# EAGLE design quadcopter (EAGLE 9.5.1)
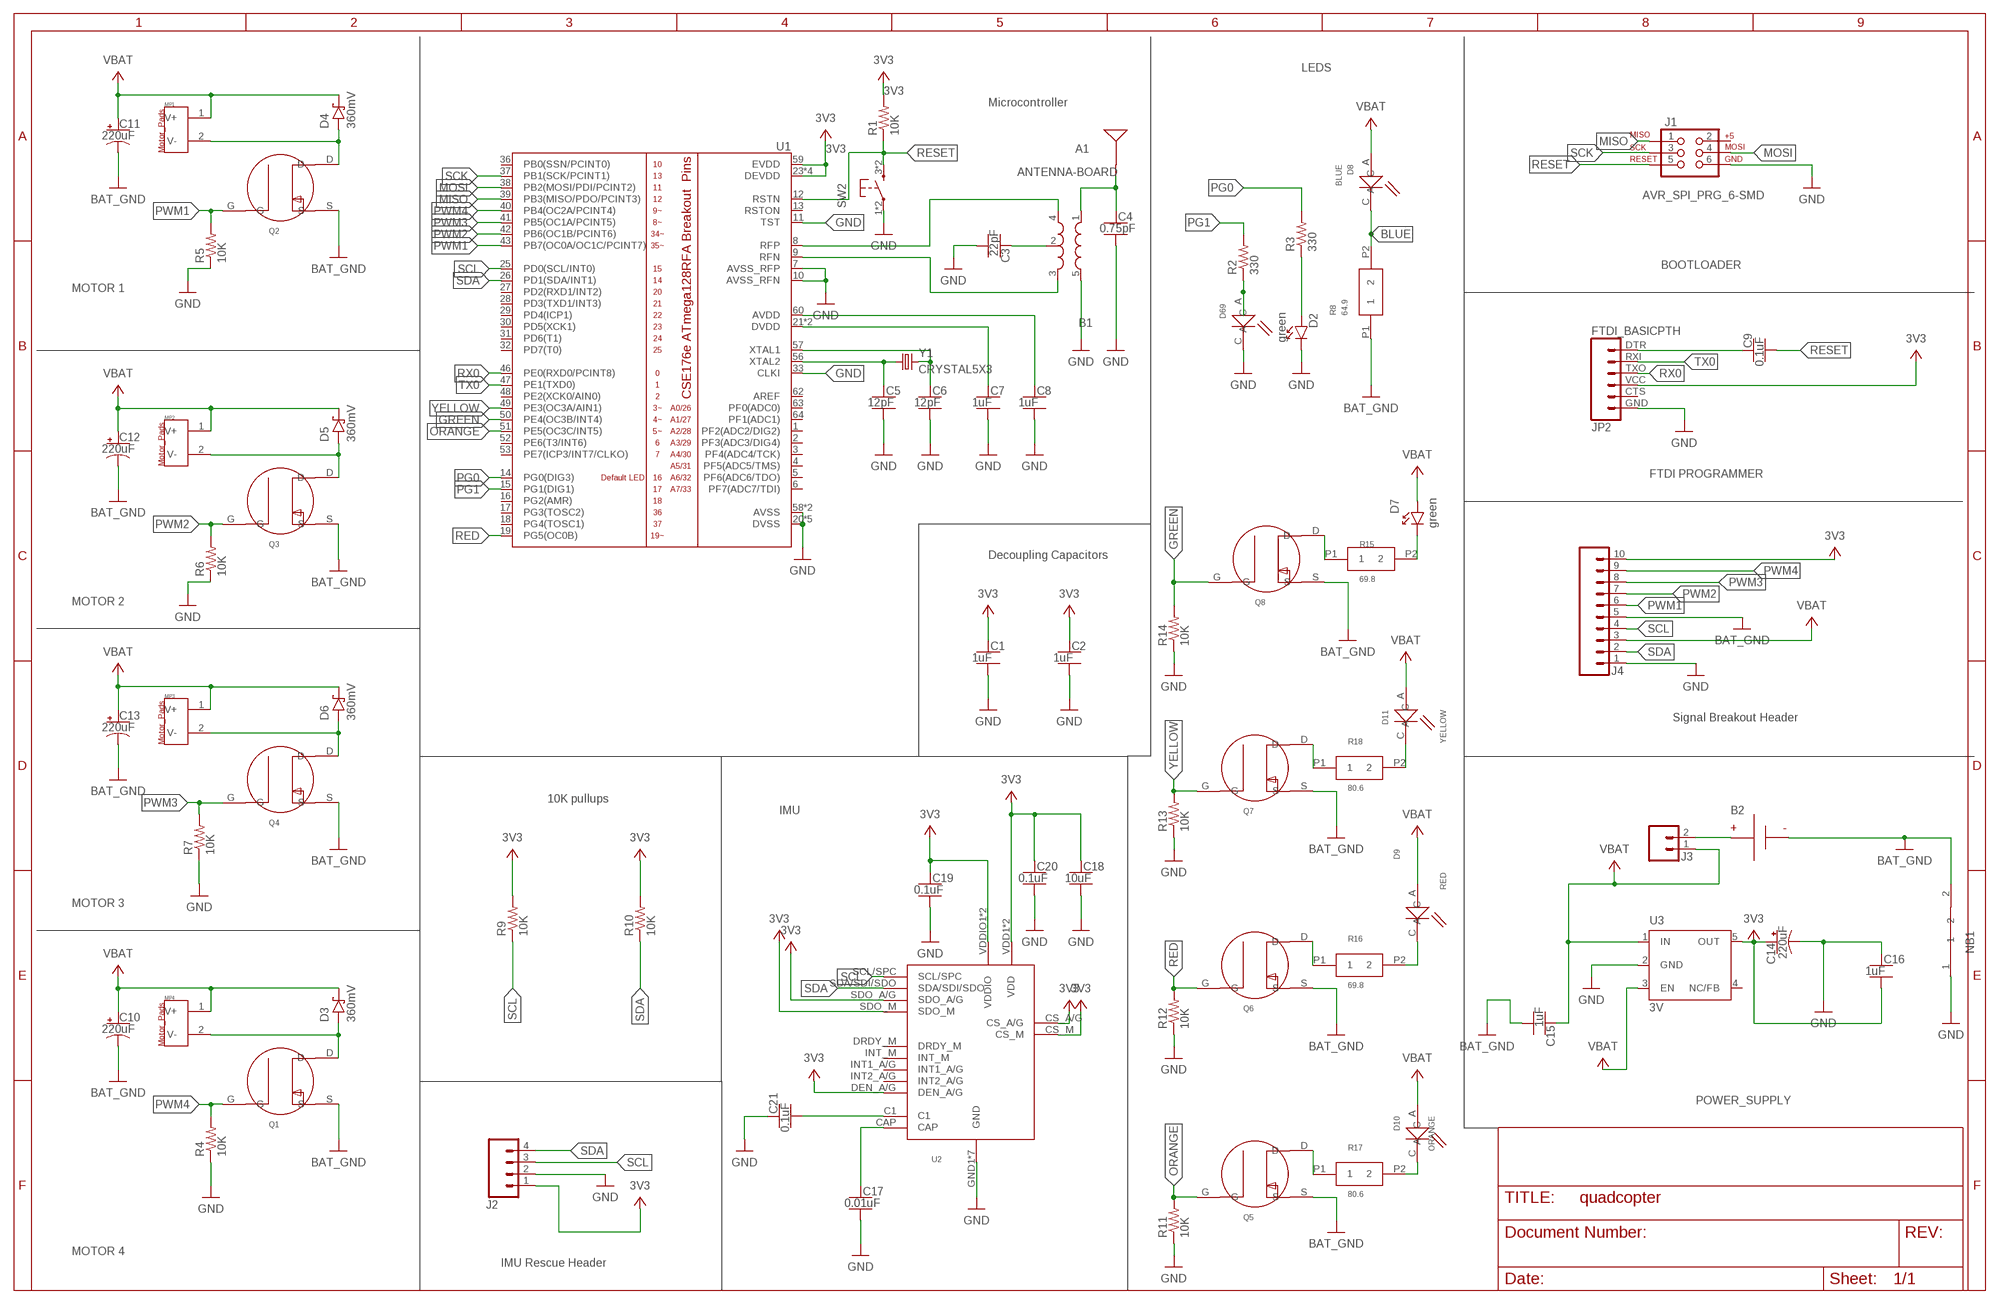
[diagram p0: schematic, sheet 1]
FRAME1 (FRAME_B_L): CREATOR: Unknown; DIST: Unknown; DISTPN: Unknown

## Parts
A1  ANTENNA-BOARD  [ANT_PCB_2.4GHZ_NRF8001_1.6MM_1OZ]
B1  BALUN0805  [BALUN]
B2  BATTERY-SCREW-TERMINAL  [SCREW-TERMINAL-1X2-2.54MM]
C1  1uF  CAPACITOR-NP_SMD-2012-0805_CERAMIC-1UF  [CAPC2012X140_HS]
C2  1uF  CAPACITOR-NP_SMD-2012-0805_CERAMIC-1UF  [CAPC2012X140_HS]
C3  22pF  CAPACITOR-NP_SMD-2012-0805_CERAMIC-22PF  [CAPC2012X140_HS]
C4  0.75pF  CAPACITOR-NP_SMD-2012-0805_CERAMIC-0.75PF  [CAPC2012X140_HS]
C5  12pF  CAPACITOR-NP_SMD-2012-0805_CERAMIC-12PF  [CAPC2012X140_HS]
C6  12pF  CAPACITOR-NP_SMD-2012-0805_CERAMIC-12PF  [CAPC2012X140_HS]
C7  1uF  CAPACITOR-NP_SMD-2012-0805_CERAMIC-1UF  [CAPC2012X140_HS]
C8  1uF  CAPACITOR-NP_SMD-2012-0805_CERAMIC-1UF  [CAPC2012X140_HS]
C9  0.1uF  CAPACITOR-NP_SMD-2012-0805_CERAMIC-0.1UF  [CAPC2012X140_HS]
C10  220uF  CAPACITOR-POL_SMD-7043-D_TANTALUM-220UF  [CAPMP7343X310_HS]
C11  220uF  CAPACITOR-POL_SMD-7043-D_TANTALUM-220UF  [CAPMP7343X310_HS]
C12  220uF  CAPACITOR-POL_SMD-7043-D_TANTALUM-220UF  [CAPMP7343X310_HS]
C13  220uF  CAPACITOR-POL_SMD-7043-D_TANTALUM-220UF  [CAPMP7343X310_HS]
C14  220uF  CAPACITOR-POL_SMD-7043-D_TANTALUM-220UF  [CAPMP7343X310_HS]
C15  1uF  CAPACITOR-NP_SMD-2012-0805_CERAMIC-1UF  [CAPC2012X140_HS]
C16  1uF  CAPACITOR-NP_SMD-2012-0805_CERAMIC-1UF  [CAPC2012X140_HS]
C17  0.01uF  CAPACITOR-NP_SMD-2012-0805_CERAMIC-0.01UF  [CAPC2012X140_HS]
C18  10uF  CAPACITOR-NP_SMD-2012-0805_CERAMIC-10UF  [CAPC2012X140_HS]
C19  0.1uF  CAPACITOR-NP_SMD-2012-0805_CERAMIC-0.1UF  [CAPC2012X140_HS]
C20  0.1uF  CAPACITOR-NP_SMD-2012-0805_CERAMIC-0.1UF  [CAPC2012X140_HS]
C21  0.1uF  CAPACITOR-NP_SMD-2012-0805_CERAMIC-0.1UF  [CAPC2012X140_HS]
D2  green  DIODE-LED_SMD-2012-0805-GREEN  [LEDSC125X200X120-2_HS]
D3  360mV  DIODE-SCHOTTKY_SMD-SOD123-360MV  [SOD3716X135_HS]
D4  360mV  DIODE-SCHOTTKY_SMD-SOD123-360MV  [SOD3716X135_HS]
D5  360mV  DIODE-SCHOTTKY_SMD-SOD123-360MV  [SOD3716X135_HS]
D6  360mV  DIODE-SCHOTTKY_SMD-SOD123-360MV  [SOD3716X135_HS]
D7  green  DIODE-LED_SMD-2012-0805-GREEN  [LEDSC125X200X120-2_HS]
D8  BLUE  LED-BLUE  [0805_LED]
D9  RED  LEDRED  [0805_LED]
D10  ORANGE  LED-ORANGE  [0805_LED]
D11  YELLOW  LED-YELLOW  [0805_LED]
D69  LEDRED  [0805_LED]
J1  AVR_SPI_PRG_6-SMD  [2X3-SMD]
J2  HEADER-4POS-0.1IN-FEMALE  [HDRVR4W80P254_1X4_1066X254X850B]
J3  HEADER-0.1IN-2POS-MALE  [HDRV2W63P254_2X1_508X254H838_HS]
J4  HEADER-10POSTH-254X10  [HDRV10W63P254_10X1_2540X254H838_HS]
JP2  FTDI_BASICPTH  [FTDI_BASIC]
MP1  MOTOR_PADS-MOLEX-0530470210  [MOLEX-0530470210]
MP2  MOTOR_PADS-MOLEX-0530470210  [MOLEX-0530470210]
MP3  MOTOR_PADS-MOLEX-0530470210  [MOLEX-0530470210]
MP4  MOTOR_PADS-MOLEX-0530470210  [MOLEX-0530470210]
NB1  NETBRIDGE  [NET_BRIDGE]
Q1  NMOSFET-NMOSFET  [N-CH_MOSFET]
Q2  NMOSFET-NMOSFET  [N-CH_MOSFET]
Q3  NMOSFET-NMOSFET  [N-CH_MOSFET]
Q4  NMOSFET-NMOSFET  [N-CH_MOSFET]
Q5  NMOSFET-NMOSFET  [N-CH_MOSFET]
Q6  NMOSFET-NMOSFET  [N-CH_MOSFET]
Q7  NMOSFET-NMOSFET  [N-CH_MOSFET]
Q8  NMOSFET-NMOSFET  [N-CH_MOSFET]
R1  10K  RESISTOR_SMD-2012-0805-10K  [RESC2012X60_HS]
R2  330  RESISTOR_SMD-2012-0805-330  [RESC2012X60_HS]
R3  330  RESISTOR_SMD-2012-0805-330  [RESC2012X60_HS]
R4  10K  RESISTOR_SMD-2012-0805-10K  [RESC2012X60_HS]
R5  10K  RESISTOR_SMD-2012-0805-10K  [RESC2012X60_HS]
R6  10K  RESISTOR_SMD-2012-0805-10K  [RESC2012X60_HS]
R7  10K  RESISTOR_SMD-2012-0805-10K  [RESC2012X60_HS]
R8  64.9  RESISTOR-64.9OHM  [0805_RESISTOR]
R9  10K  RESISTOR_SMD-2012-0805-10K  [RESC2012X60_HS]
R10  10K  RESISTOR_SMD-2012-0805-10K  [RESC2012X60_HS]
R11  10K  RESISTOR_SMD-2012-0805-10K  [RESC2012X60_HS]
R12  10K  RESISTOR_SMD-2012-0805-10K  [RESC2012X60_HS]
R13  10K  RESISTOR_SMD-2012-0805-10K  [RESC2012X60_HS]
R14  10K  RESISTOR_SMD-2012-0805-10K  [RESC2012X60_HS]
R15  69.8  RESISTOR-69.8OHM  [0805_RESISTOR]
R16  69.8  RESISTOR-69.8OHM  [0805_RESISTOR]
R17  80.6  RESISTOR-80.6OHM  [0805_RESISTOR]
R18  80.6  RESISTOR-80.6OHM  [0805_RESISTOR]
SW2  PUSHBUTTON_-4.5X4.5  [4.5MM_TACTILE_SWITCH_TL3305AF160QG]
U1  ATMEGA128RFA1  [QFN-64]
U2  LSM9DS1TR9AXISIMU-ACCEL/GYRO/MAGI2C/SPI24LGA  [LSM9DS1TR9-AXISIMU]
U3  3V  TPS73633-DBVT3V  [SOT23-DBV]
Y1  CRYSTAL5X3  [CRYSTAL-SMD-5X3]

## Nets
3V3 [PWR]: C1.1 C2.1 C14.1(+) C16.2 C18.1 C19.1 C20.1 J2.1 J4.10 JP2.VCC R1.2 R9.2 R10.2 U1.23(DEVDD) U1.34(DEVDD) U1.44(DEVDD) U1.54(DEVDD) U1.59(EVDD) U2.CS_A/G U2.CS_M U2.DEN_A/G U2.SDO_A/G U2.SDO_M U2.VDD1(VDD) U2.VDD2(VDD) U2.VDDIO1(VDDIO) U2.VDDIO2(VDDIO) U3.5(OUT)
A2: B1.4(OUT1) U1.8(RFP)
A3: B1.2(GND) C3.1
A4: B1.3(OUT2) U1.9(RFN)
ANT1 [RFSIG]: A1.FEED(SIGNAL) B1.1(IN) C4.1
BAT_GND [HIGHCURRENT]: B2.1(N) C10.2(-) C11.2(-) C12.2(-) C13.2(-) C15.2 J4.5 NB1.2 Q1.S Q2.S Q3.S Q4.S Q5.S Q6.S Q7.S Q8.S R8.P1
BLUE: D8.C R8.P2
GND [PWR]: B1.5(GND) C1.2 C2.2 C3.2 C4.2 C5.2 C6.2 C7.2 C8.2 C14.2(-) C16.1 C17.2 C18.2 C19.2 C20.2 C21.1 D2.C D69.C J1.6 J2.2 J4.1 JP2.GND NB1.1 R4.1 R5.1 R6.1 R7.1 R11.1 R12.1 R13.1 R14.1 SW2.1 SW2.2 U1.7(AVSS_RFP) U1.10(AVSS_RFN) U1.11(TST) U1.20(DVSS) U1.24(DVSS) U1.33(CLKI) U1.35(DVSS) U1.45(DVSS) U1.55(DVSS) U1.58(AVSS) U1.61(AVSS) U2.GND1(GND) U2.GND2(GND) U2.RES1(GND) U2.RES2(GND) U2.RES3(GND) U2.RES4(GND) U2.RES5(GND) U3.2(GND)
GREEN: Q8.G R14.2 U1.50(PE4(OC3B/INT4))
MISO: J1.1 U1.39(PB3(MISO/PDO/PCINT3))
MOSI: J1.4 U1.38(PB2(MOSI/PDI/PCINT2))
N$1: C5.1 U1.56(XTAL2) Y1.1
N$2: C6.1 U1.57(XTAL1) Y1.3
N$3: D2.A R3.1
N$4 [HIGHCURRENT]: B2.2(P) J3.2
N$5: C7.1 U1.21(DVDD) U1.22(DVDD)
N$6: C8.1 U1.60(AVDD)
N$7: D7.C R15.P2
N$8: Q8.D R15.P1
N$9: Q7.D R18.P1
N$13: D9.C R16.P2
N$14: Q6.D R16.P1
N$16: D10.C R17.P2
N$17: D11.C R18.P2
N$18: Q5.D R17.P1
N$22: D69.A R2.1
N$33: C9.1 JP2.DTR
N$35 [HIGHCURRENT]: D3.A MP4.2(V-) Q1.D
N$42 [HIGHCURRENT]: D4.A MP1.2(V-) Q2.D
N$44 [HIGHCURRENT]: D5.A MP2.2(V-) Q3.D
N$45: C17.1 U2.CAP
N$46 [HIGHCURRENT]: D6.A MP3.2(V-) Q4.D
N$50: C21.2 U2.C1
ORANGE: Q5.G R11.2 U1.51(PE5(OC3C/INT5))
PG0: R3.2 U1.14(PG0(DIG3))
PG1: R2.2 U1.15(PG1(DIG1))
PWM1: J4.6 Q2.G R5.2 U1.43(PB7(OC0A/OC1C/PCINT7))
PWM2: J4.7 Q3.G R6.2 U1.42(PB6(OC1B/PCINT6))
PWM3: J4.8 Q4.G R7.2 U1.41(PB5(OC1A/PCINT5))
PWM4: J4.9 Q1.G R4.2 U1.40(PB4(OC2A/PCINT4))
RED: Q6.G R12.2 U1.19(PG5(OC0B))
RESET: C9.2 J1.5 R1.1 SW2.3 SW2.4 U1.12(RSTN)
RX0: JP2.TXO U1.46(PE0(RXD0/PCINT8))
SCK: J1.3 U1.37(PB1(SCK/PCINT1))
SCL: J2.3 J4.4 R9.1 U1.25(PD0(SCL/INT0)) U2.SCL/SPC
SDA: J2.4 J4.2 R10.1 U1.26(PD1(SDA/INT1)) U2.SDA/SDI/SDO
TX0: JP2.RXI U1.47(PE1(TXD0))
VBAT [HIGHCURRENT]: C10.1(+) C11.1(+) C12.1(+) C13.1(+) C15.1 D3.C D4.C D5.C D6.C D7.A D8.A D9.A D10.A D11.A J3.1 J4.3 MP1.1(V+) MP2.1(V+) MP3.1(V+) MP4.1(V+) U3.1(IN) U3.3(EN)
YELLOW: Q7.G R13.2 U1.49(PE3(OC3A/AIN1))
Unconnected: J1.2 JP2.CTS U1.1(PF2(ADC2/DIG2)) U1.2(PF3(ADC3/DIG4)) U1.3(PF4(ADC4/TCK)) U1.4(PF5(ADC5/TMS)) U1.5(PF6(ADC6/TDO)) U1.6(PF7(ADC7/TDI)) U1.13(RSTON) U1.16(PG2(AMR)) U1.17(PG3(TOSC2)) U1.18(PG4(TOSC1)) U1.27(PD2(RXD1/INT2)) U1.28(PD3(TXD1/INT3)) U1.29(PD4(ICP1)) U1.30(PD5(XCK1)) U1.31(PD6(T1)) U1.32(PD7(T0)) U1.36(PB0(SSN/PCINT0)) U1.48(PE2(XCK0/AIN0)) U1.52(PE6(T3/INT6)) U1.53(PE7(ICP3/INT7/CLKO)) U1.62(AREF) U1.63(PF0(ADC0)) U1.64(PF1(ADC1)) U2.DRDY_M U2.INT1_A/G U2.INT2_A/G U2.INT_M U3.4(NC/FB)

## Notes on the sheet
- LEDS
- Microcontroller
- BOOTLOADER
- MOTOR 1
- FTDI PROGRAMMER
- Decoupling Capacitors
- MOTOR 2
- Signal Breakout Header
- 10K pullups
- IMU
- MOTOR 3
- POWER_SUPPLY
- MOTOR 4
- IMU Rescue Header

## Library data of the parts
A1 = quadparts_prebuilt:ANTENNA: Single endded antenna.; CREATOR: Swanson; DIST: NA; DISTPN: NA; MOUNTING: NONE
B1 = quadparts_prebuilt:BALUN: A balun to convert differential radio-frequency outputs from the microcontroller into a single-ended driver for the antenna.; CREATOR: Swanson; DATASHEET: http://katalog.we-online.de/pbs/datasheet/748421245.pdf; DIST: Digikey; DISTPN: 732-2230-1-ND; MFR: Wurth Electronics Inc; MOUNTING: SMD; MPN: 748421245; PRICE: 2.63; REVIEWER: Swanson
B2 = quadparts_prebuilt:BATTERY: Connections for a battery.; CREATOR: Swanson; DIST: DIGIKEY; DISTPN: ED10561-ND; MOUNTING: TH; PIN1: -; PIN2: +
C1 C2 C7 C8 C15 C16 = quadparts_prebuilt:CAPACITOR-NP_: Nonpolarized capacitor; CREATOR: Swanson; DIST: Digikey; DISTPN: 587-1281-1-ND; MFR: Taiyo Yuden; MOUNTING: SMD; MPN: TMK212B7105KG-T; REVIEWER: Swanson
C3 = quadparts_prebuilt:CAPACITOR-NP_: Nonpolarized capacitor; CREATOR: Swanson; DIST: Digikey; DISTPN: 490-5534-1-ND; MFR: Murata Electronics North America; MOUNTING: SMD; MPN: GRM21A5C2E220JW01D; REVIEWER: Swanson
C4 = quadparts_prebuilt:CAPACITOR-NP_: Nonpolarized capacitor; CREATOR: Swanson; DIST: Digikey; DISTPN: 490-3585-1-ND; MFR: Murata Electronics North America; MOUNTING: SMD; MPN: GQM2195C2AR75CB01D; REVIEWER: Swanson
C5 C6 = quadparts_prebuilt:CAPACITOR-NP_: Nonpolarized capacitor; CREATOR: Swanson; DIST: Digikey; DISTPN: 490-5531-1-ND; MFR: Murata Electronics North America; MOUNTING: SMD; MPN: GRM21A5C2E120JW01D; REVIEWER: Swanson
C9 C19-C21 = quadparts_prebuilt:CAPACITOR-NP_: Nonpolarized capacitor; CREATOR: Swanson; DIST: Digikey; DISTPN: 445-1418-1-ND; MFR: TDK; MOUNTING: SMD; MPN: C2012X7R2A104K125AA; REVIEWER: Swanson
C10-C14 = quadparts_prebuilt:CAPACITOR-POL_: Polarized capacitor; CREATOR: Swanson; DIST: Digikey; DISTPN: 478-8912-1-ND; MFR: AVX Corporation; MOUNTING: SMD; MPN: TAJD227K006RNJ; REVIEWER: Swanson
C17 = quadparts_prebuilt:CAPACITOR-NP_: Nonpolarized capacitor; CREATOR: Swanson; DIST: Digikey; DISTPN: 1608-1458-1-ND; MFR: Knowles Syfer; MOUNTING: SMD; MPN: 0805J0500104KJT; REVIEWER: Swanson
C18 = quadparts_prebuilt:CAPACITOR-NP_: Nonpolarized capacitor; CREATOR: Swanson; DIST: Digikey; DISTPN: 445-5984-1-ND; MOUNTING: SMD; REVIEWER: Swanson
D2 D7 = quadparts_prebuilt:DIODE-LED_: Light emitting diode; CREATOR: Swanson; DIST: Digikey; DISTPN: 160-1179-1-ND; MFR: Lite-On Inc; MOUNTING: SMD; MPN: LTST-C170GKT; REVIEWER: Swanson
D3-D6 = quadparts_prebuilt:DIODE-SCHOTTKY_: Schottky diode; CREATOR: Swanson; DIST: Digikey; DISTPN: CRS08QMCT-ND; MFR: Toshiba Semiconductor and Storage; MOUNTING: SMD; MPN: CRS08(TE85L,Q,M); REVIEWER: Swanson
D8 = LED:LED; CREATOR: robntom; DIST: digikey; DISTPN: 846-1207-1-ND
D9 D69 = custom:LED; CREATOR: robntom; DIST: digikey; DISTPN: 160-1178-1-ND
D10 = LED:LED; CREATOR: ROBTOM; DIST: Digikey; DISTPN: 754-1936-1-ND
D11 = LED:LED; CREATOR: ROBTOM; DIST: Digikey; DISTPN: 754-1937-1-ND
J1 = quadparts_prebuilt:AVR_SPI_PRG_6: AVR ISP 6 Pin This is the in-system programming (ISP) connector for Atmel Microcontrollers programming.; CREATOR: Swanson; DIST: Digikey; DISTPN: 952-1922-ND; MOUNTING: SMD
J2 = quadparts_prebuilt:HEADER-4POS; CREATOR: Swanson; DIST: Digikey; DISTPN: S7002-ND
J3 = quadparts_prebuilt:HEADER-0.1IN-2POS: 2 pin header; CREATOR: Swanson; DIST: Digikey; DISTPN: 3M9447-ND; MOUNTING: TH
J4 = quadparts_prebuilt:HEADER-10POS: 10 pin single inline pin header, socket, or connector; CREATOR: Swanson; DATASHEET: http://portal.fciconnect.com/Comergent//fci/drawing/68000.pdf; DIST: Digikey; DISTPN: 609-3250-ND; MFR: Amphenol FCI; MOUNTING: TH; MPN: 68000-110HLF; PRICE: 0.55; REVIEWER: Swanson
JP2 = quadparts_prebuilt:FTDI_BASIC: FTDI (USB-serial converter) header bins with labels.; CREATOR: Swanson; DATASHEET: http://portal.fciconnect.com/Comergent//fci/drawing/68015.pdf; DIST: Digikey; DISTPN: 609-3327-ND; MFR: Amphenol FCI; MOUNTING: TH; MPN: 68016-406HLF; PRICE: 0.33; REVIEWER: Swanson
MP1-MP4 = quadparts_prebuilt:MOTOR_PADS: Connections a brushed motor.; CREATOR: Swanson; DIST: DIGIKEY; DISTPN: WM1731-ND; MOUNTING: TH
NB1 = LED:NETBRIDGE; CREATOR: tom+rob; DIST: N/A; DISTPN: N/A
Q1-Q8 = custom:NMOSFET; CREATOR: rketch; DIST: Digikey; DISTPN: SI2302CDS-T1-E3CT-ND
R1 R4-R7 R9-R14 = quadparts_prebuilt:RESISTOR_: Resistor; CREATOR: Swanson; DIST: Digikey; DISTPN: 311-10KARCT-ND; MFR: Yageo; MOUNTING: SMD; MPN: RC0805JR-0710KL; REVIEWER: Swanson
R2 R3 = quadparts_prebuilt:RESISTOR_: Resistor; CREATOR: Swanson; DIST: Digikey; DISTPN: 311-330ARCT-ND; MFR: Yageo; MOUNTING: SMD; MPN: RC0805JR-07330RL; REVIEWER: Swanson
R8 = LED:RESISTOR; CREATOR: ROBTOM; DIST: Digikey; DISTPN: 311-64.9CRCT-ND
R15 R16 = LED:RESISTOR; CREATOR: ROBTOM; DIST: Digikey; DSPN: 311-69.8CRCT-ND
R17 R18 = LED:RESISTOR; CREATOR: ROBTOM; DIST: Digikey; DISTPN: P80.6DACT-ND
SW2 = quadparts_prebuilt:PUSHBUTTON_: "Tactile" or "clicky" button.; CREATOR: Swanson; DIST: DIGIKEY; DISTPN: EG5350CT-ND; MOUNTING: SMD
U1 = quadparts_prebuilt:ATMEGA128RFA1: ATmega128RFA1 8-bit AVR Microcontroller with Low Power 2.4GHz Transceiver for ZigBee and IEEE 802.15.4; CREATOR: Swanson; DATASHEET: http://www.atmel.com/Images/Atmel-8266-MCU_Wireless-ATmega128RFA1_Datasheet.pdf; DIST: Digikey; DISTPN: ATMEGA128RFA1-ZU-ND; MFR: Atmel; MOUNTING: SMD; MPN: ATMEGA128RFA1-ZUR00; PRICE: 10.21; REVIEWER: Swanson
U2 = custom:LSM9DS1TR9AXISIMU; CREATOR: rketch; DIST: Digikey; DISTPN: 497-14946-1-ND
U3 = quadparts_prebuilt:TPS73633-DBVT: LP3985-series voltage regulators.; CREATOR: Swanson; DATASHEET: http://www.ti.com/lit/ds/symlink/lp3985.pdf; DIST: Digikey; DISTPN: LP3985IM5X-3.0/NOPBCT-ND; MFR: Texas Instruments; MOUNTING: SMD; MPN: LP3985IM5X-3.0/NOPB; PRICE: 0.59; REVIEWER: Swanson
Y1 = quadparts_prebuilt:CRYSTAL: Crystals to provide clock references for microcontrollers, etc.; CREATOR: Swanson; DATASHEET: http://www.abracon.com/Resonators/abm3b.pdf; DIST: Digikey; DISTPN: 535-9122-1-ND; MFR: Abracon LLC; MOUNTING: SMD; MPN: ABM3B-16.000MHZ-B2-T; PRICE: 0.68; PROD_ID: XTAL-08218; REVIEWER: Swanson

## Net classes
1 RFSIG: width 1.27 mm
2 PWR: width 0.254 mm
3 HIGHCURRENT: width 0.762 mm, drill 0.61 mm

## Board
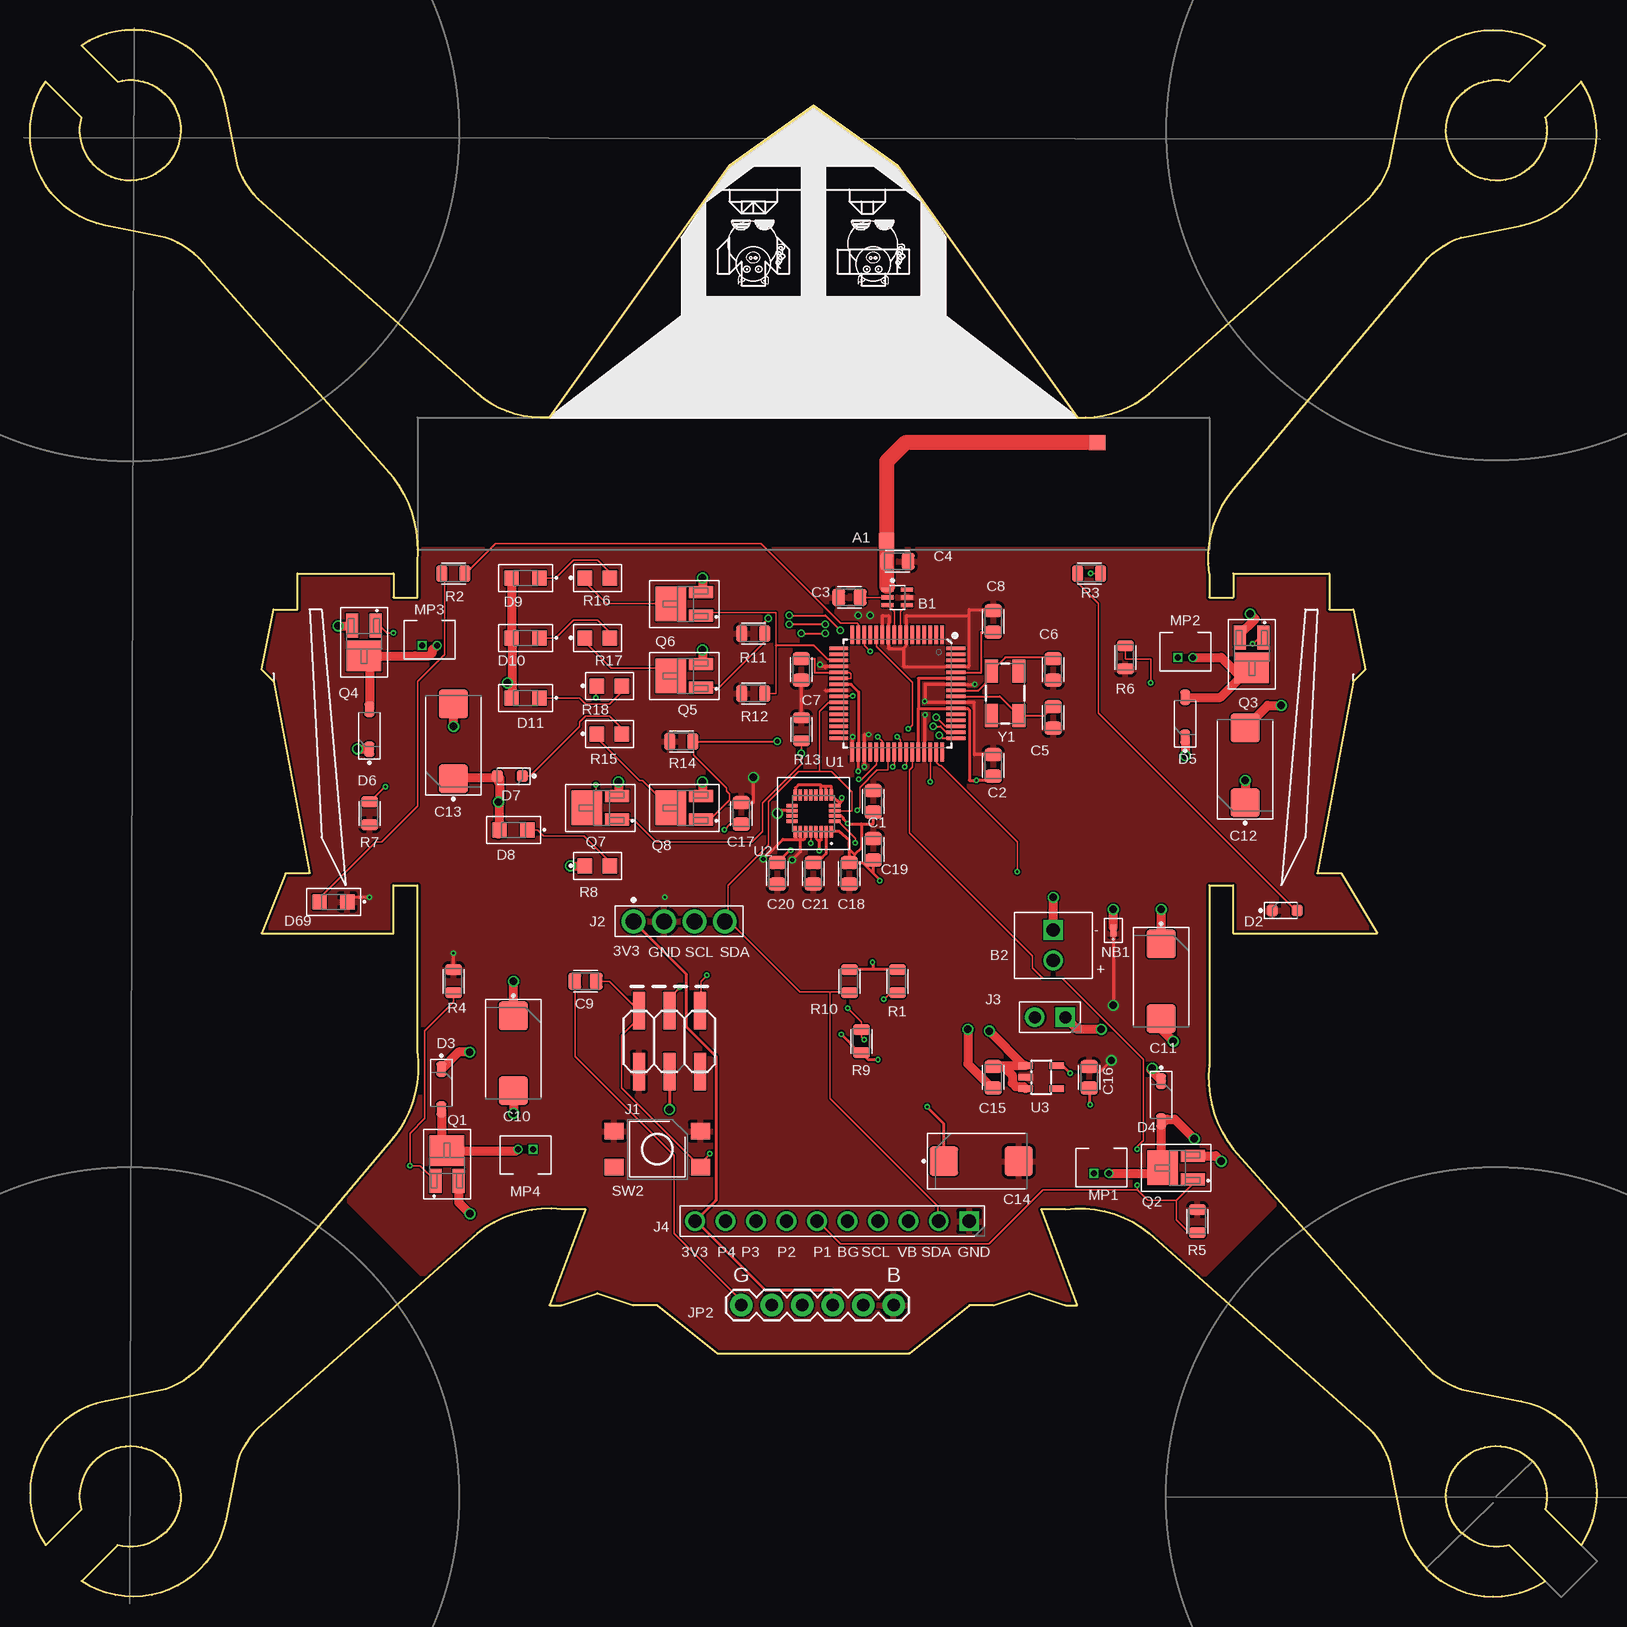
[diagram p1: board, top side]
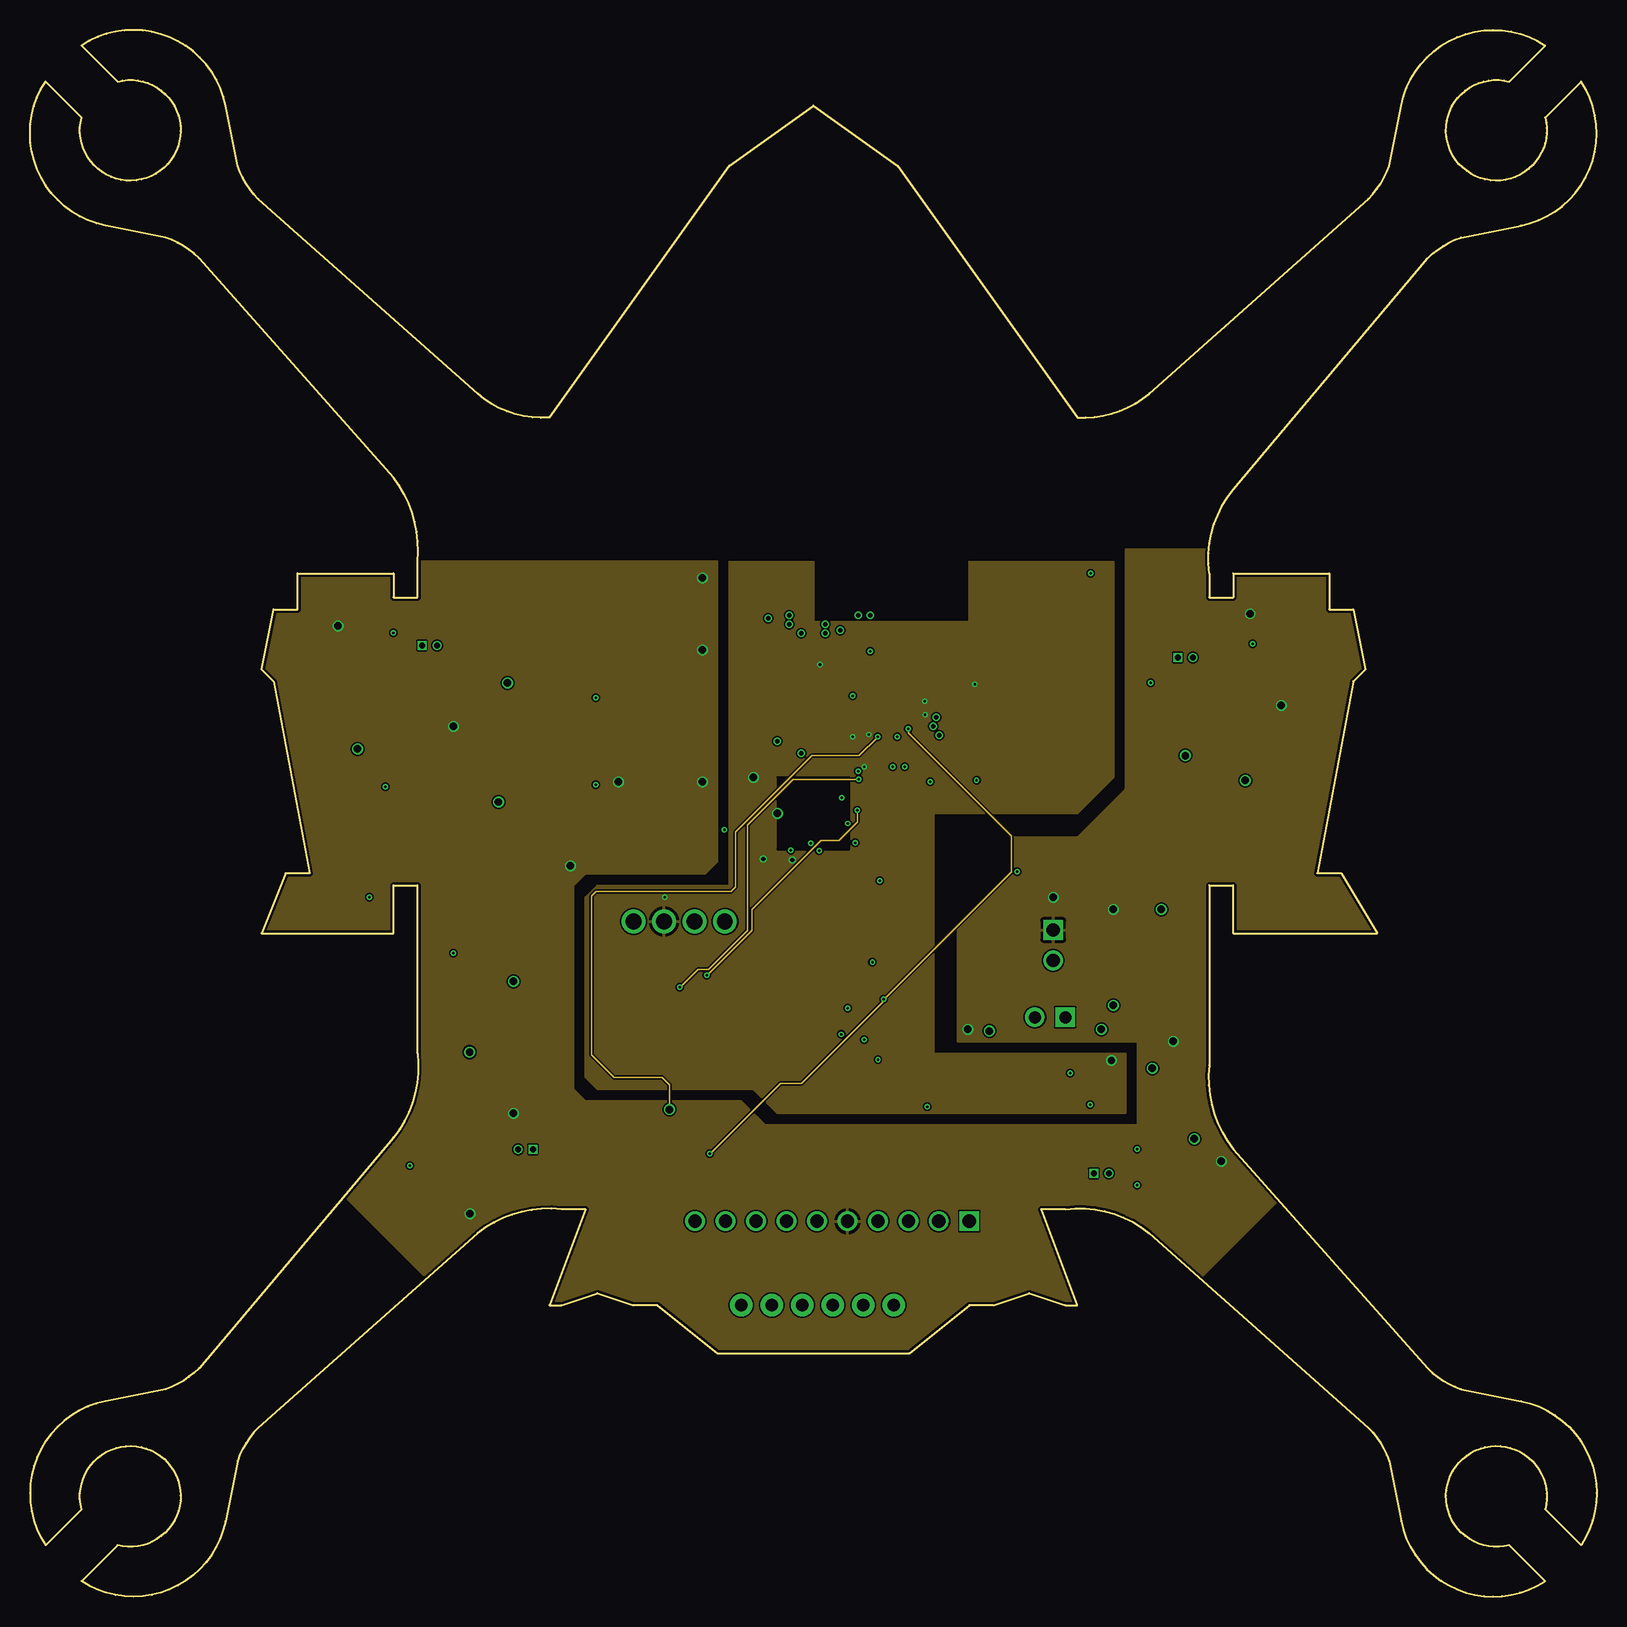
[diagram p2: board, inner layer Route2]
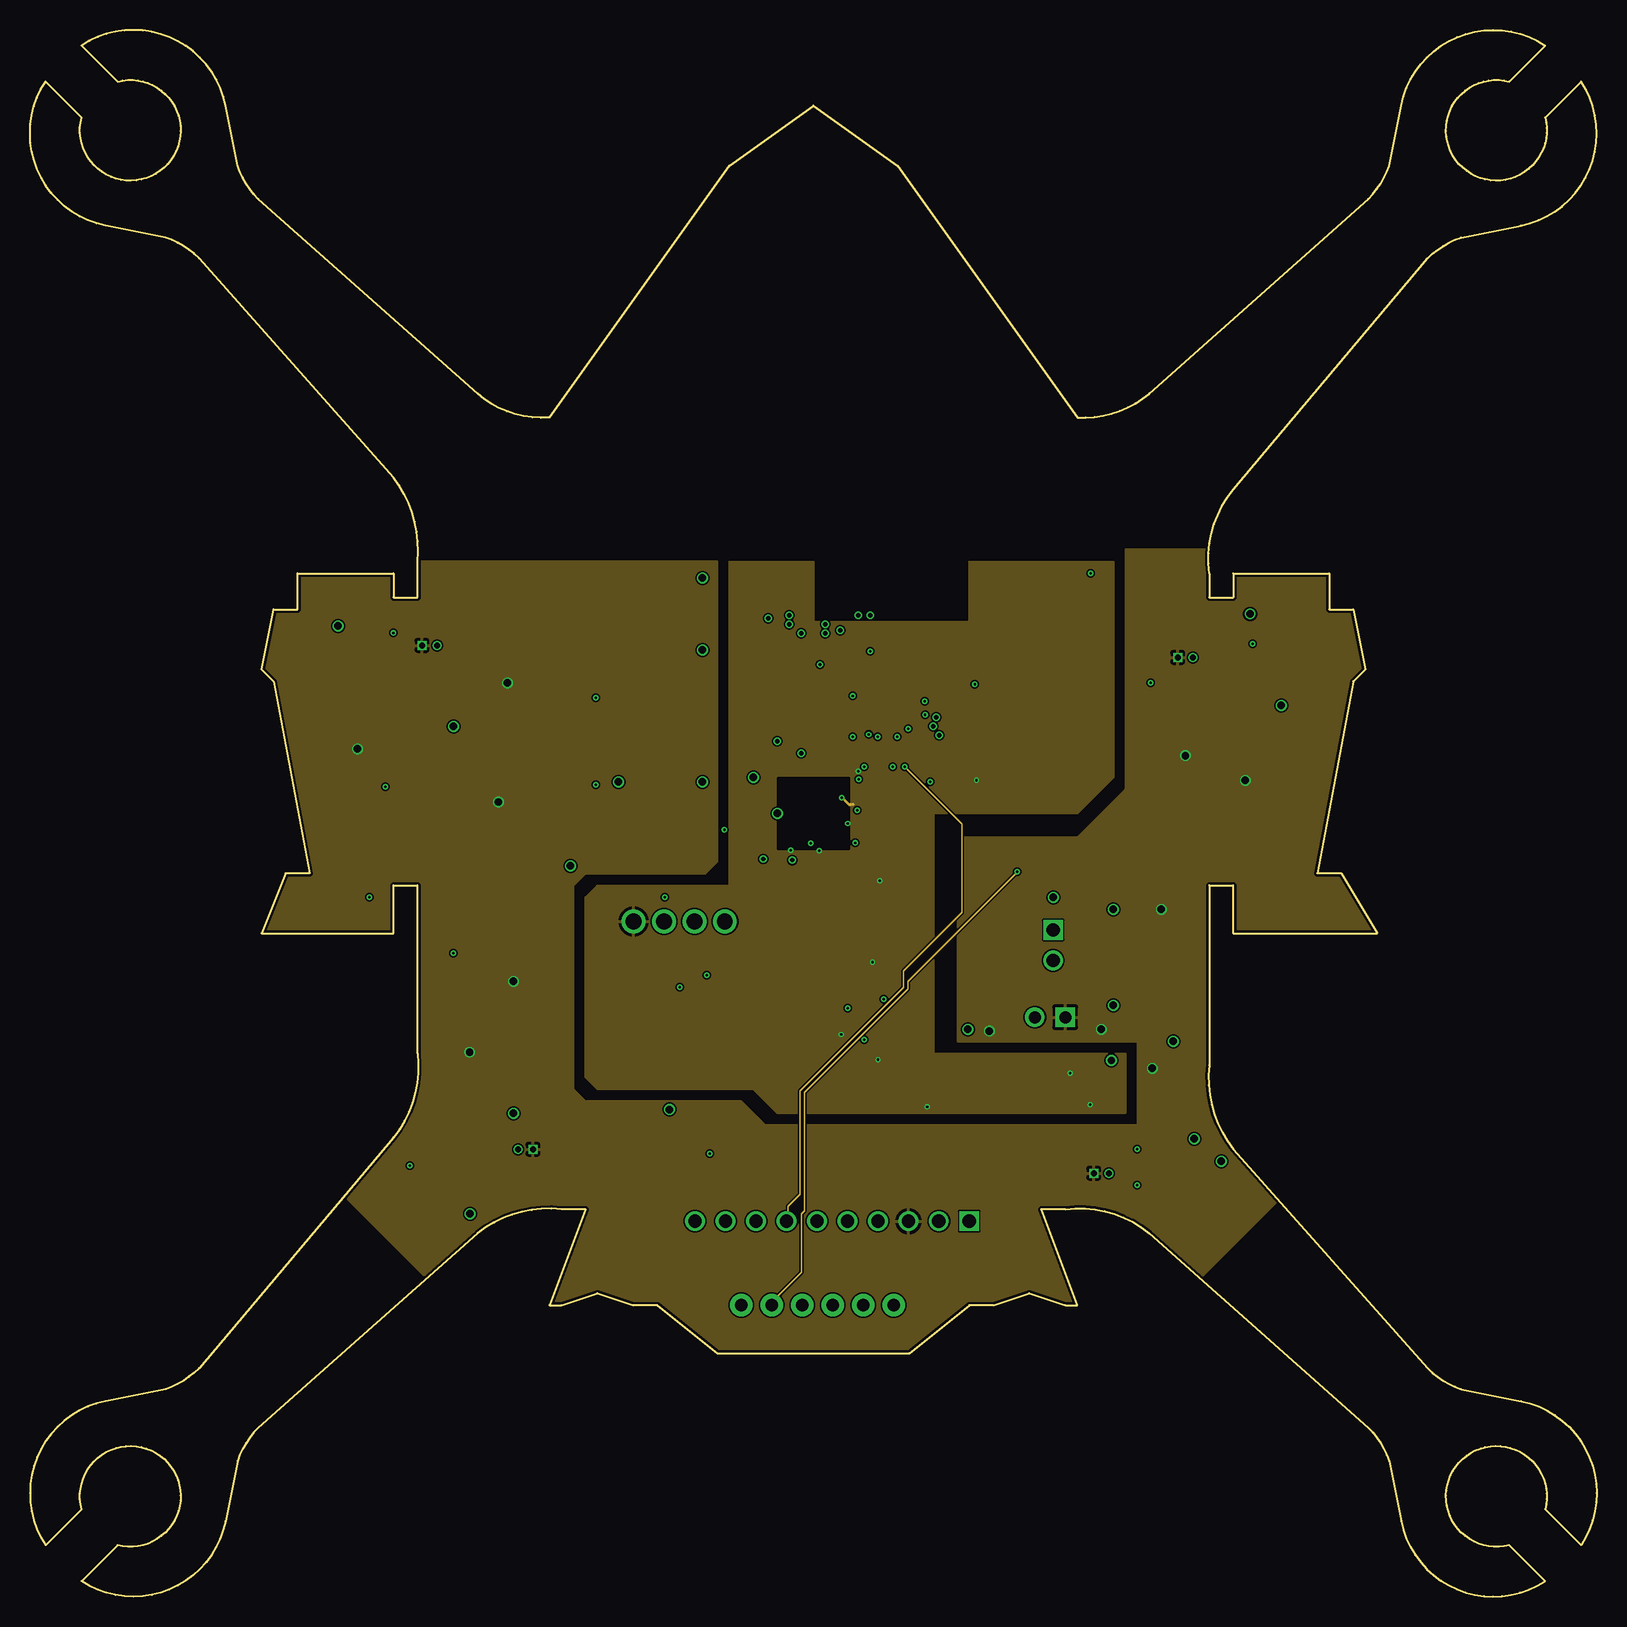
[diagram p3: board, inner layer Route15]
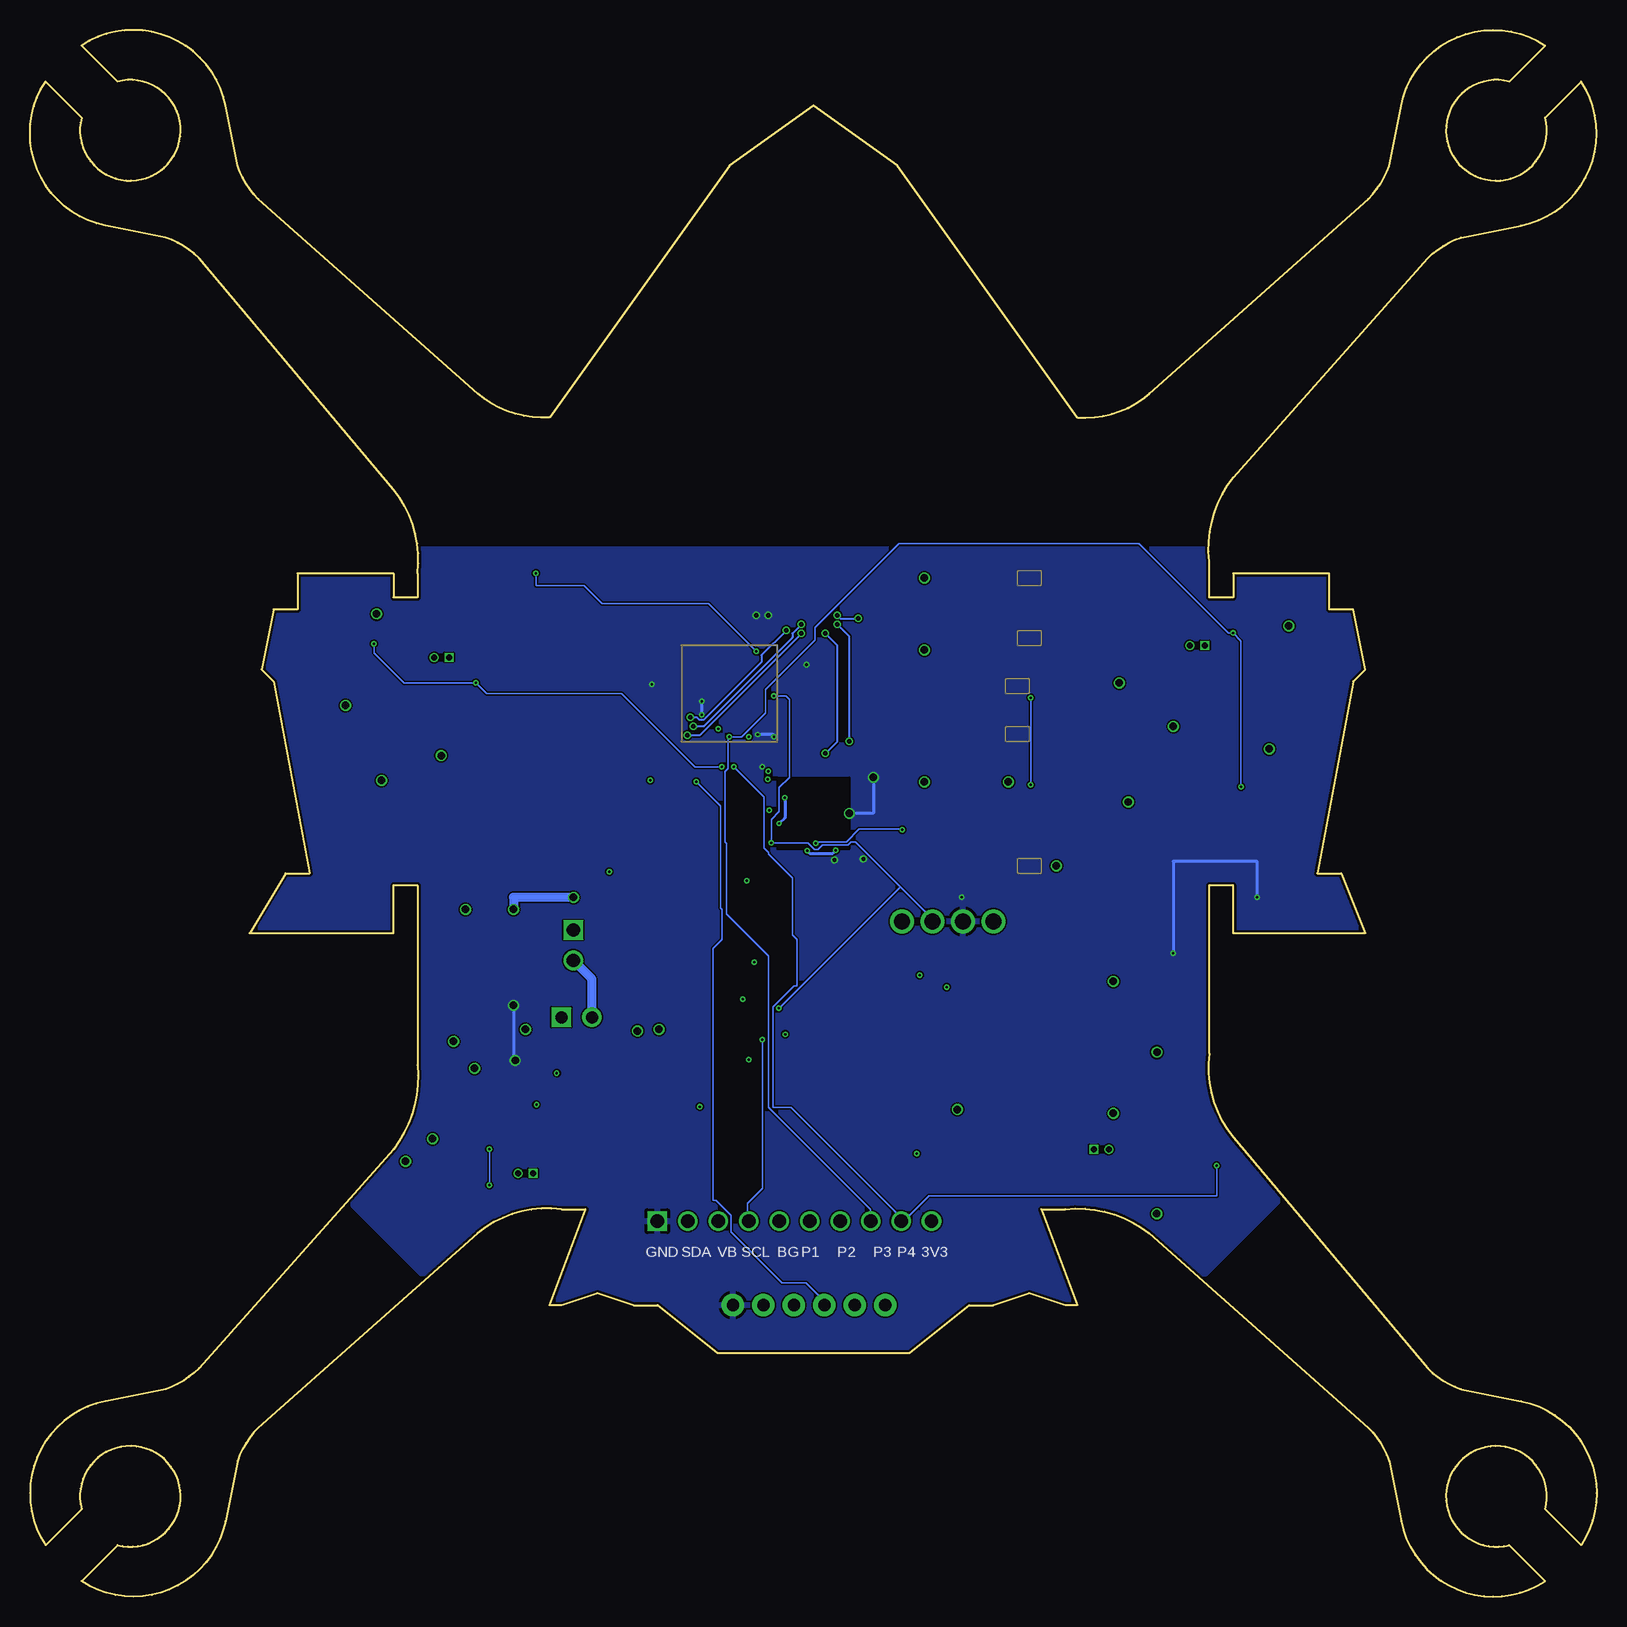
[diagram p4: board, bottom side, seen from below]

Size 130.6 x 130.6 mm. Coordinates in mm from the lower left corner, seen from the top.
Outline: 100.3,92.3 116.51,111.56 arc-26 119.3,113.3 124.3,114.3 arc112 129.3,126.3 126.3,123.3 arc-299 123.3,126.3 126.3,129.3 arc112 114.3,124.3 113.3,119.3 arc-26 111.56,116.51 93.3,100.3 arc-44 87.3,98.3 72.3,119.3 65.3,124.3 58.3,119.3 43.3,98.3 arc-46 37.3,100.3 19.04,116.51 arc-26 17.3,119.3 16.3,124.3 arc112 4.3,129.3 7.3,126.3 arc-299 4.3,123.3 1.3,126.3 arc112 6.3,114.3 11.3,113.3 arc-26 14.09,111.56 30.3,93.3 arc-44 32.3,86.3 32.3,83.3 30.3,83.3 30.3,85.3 22.3,85.3 22.3,82.3 20.3,82.3 19.3,77.3 20.3,76.3 23.3,60.3 21.3,60.3 19.3,55.3 30.3,55.3 30.3,59.3 32.3,59.3 32.3,45.3 arc-46 30.3,38.3 14.09,19.04 arc-26 11.3,17.3 6.3,16.3 arc112 1.3,4.3 4.3,7.3 arc-299 7.3,4.3 4.3,1.3 arc112 16.3,6.3 17.3,11.3 arc-26 19.04,14.09 37.3,30.3 arc-44 44.3,32.3 46.3,32.3 43.3,24.3 44.3,24.3 47.3,25.3 50.3,24.3 52.3,24.3 57.3,20.3 73.3,20.3 78.3,24.3 80.3,24.3 83.3,25.3 86.3,24.3 87.3,24.3 84.3,32.3 86.3,32.3 arc-46 93.3,30.3 111.56,14.09 arc-26 113.3,11.3 114.3,6.3 arc112 126.3,1.3 123.3,4.3 arc-299 126.3,7.3 129.3,4.3 arc112 124.3,16.3 119.3,17.3 arc-26 116.51,19.04 100.3,37.3 arc-44 98.3,44.3 98.3,59.3 100.3,59.3 100.3,55.3 112.3,55.3 109.3,60.3 107.3,60.3 110.3,76.3 111.3,77.3 110.3,82.3 108.3,82.3 108.3,85.3 100.3,85.3 100.3,83.3 98.3,83.3 98.3,85.3 arc-46 100.3,92.3
Copper layers (1*2*15*16): Top 0.035559375mm / dielectric 1.501140625mm / Route2 0.035559375mm / dielectric 0.149859375mm / Route15 0.035559375mm / dielectric 0.200659375mm / Bottom 0.035559375mm
Design rules "jlcpcb-4layer-5mil-small-cream": minimum track width 5mil, minimum drill 0.2mm, track to track 5mil, track to pad 5mil, pad to pad 5mil, via to via 5mil, smd to smd 5mil, copper to edge 0.2mm, drill to drill 10mil, minimum pad ring 3mil, minimum via ring 5mil, stop-mask expansion 3mil, vias tented up to drill 0.45mm, thermal gap 10mil

### Footprints (pad centres in the part's own frame; a part is rotated, then mirrored left to right if it is on the bottom)
ANT_PCB_2.4GHZ_NRF8001_1.6MM_1OZ = smd 1.27 x 1.27: FEED 0,0; TESTPOINT -8.169,17.605
BALUN = smd 0.35 x 1: 1 -0.65,-0.8; 2 0,-0.8; 3 0.65,-0.8; 4 0.65,0.8; 5 0,0.8; 6 -0.65,0.8
SCREW-TERMINAL-1X2-2.54MM = drill 1.1 square: 1 -1.27,0 | drill 1.1: 2 1.27,0
CAPC2012X140_HS = smd 1.08 x 1.42: 1 -0.895,0; 2 0.895,0
CAPMP7343X310_HS = smd 2.37 x 2.43: 1 -3.12,0; 2 3.12,0
LEDSC125X200X120-2_HS = smd 0.94 x 0.99: A -0.345,-0.9; C 1.745,-0.9
SOD3716X135_HS = smd 1.25 x 0.8: A 1.665,0; C -1.665,0
0805_LED = smd 1.2 x 1.25: A 1.85,0.625; C 4.15,0.625
2X3-SMD = smd 1 x 3.15: 1 -2.54,-2.54; 2 -2.54,2.54; 3 0,-2.54; 4 0,2.54; 5 2.54,-2.54; 6 2.54,2.54
HDRVR4W80P254_1X4_1066X254X850B = drill 1.331 pad 1.997: 1 0,0; 2 2.54,0; 3 5.08,0; 4 7.62,0
HDRV2W63P254_2X1_508X254H838_HS = drill 1 pad 1.65 square: 1 0,0 | drill 1 pad 1.65: 2 2.54,0
HDRV10W63P254_10X1_2540X254H838_HS = drill 1.1 pad 1.65 square: 1 0,0 | drill 1.1 pad 1.65: 2 2.54,0; 3 5.08,0; 4 7.62,0; 5 10.16,0; 6 12.7,0; 7 15.24,0; 8 17.78,0; 9 20.32,0; 10 22.86,0
FTDI_BASIC = drill 1.016 pad 1.88: CTS 10.16,0; DTR 0,0; GND 12.7,0; RXI 2.54,0; TXO 5.08,0; VCC 7.62,0
MOLEX-0530470210 = drill 0.5 square: 1 0.625,0 | drill 0.5: 2 -0.625,0
NET_BRIDGE = smd 0.5 x 0.5: 1 0,0; 2 0.5,0
N-CH_MOSFET = smd 2.9 x 2.55: D 1.46,1.871 | smd 1 x 2: G 0.5,-0.654; S 2.45,-0.654
RESC2012X60_HS = smd 0.92 x 1.38: 1 -0.955,0; 2 0.955,0
0805_RESISTOR = smd 1.2 x 1.25: P1 -0.05,0.625; P2 2.05,0.625
4.5MM_TACTILE_SWITCH_TL3305AF160QG = smd 1.6 x 1.4: 1 -3.6,-1.5; 2 3.6,-1.5; 3 -3.6,1.5; 4 3.6,1.5
QFN-64 = smd 1.562 x 0.28: 1 -4.881,3.75; 2 -4.881,3.25; 3 -4.881,2.75; 4 -4.881,2.25; 5 -4.881,1.75; 6 -4.881,1.25; 7 -4.881,0.75; 8 -4.881,0.25; 9 -4.881,-0.25; 10 -4.881,-0.75; 11 -4.881,-1.25; 12 -4.881,-1.75; 13 -4.881,-2.25; 14 -4.881,-2.75; 15 -4.881,-3.25; 16 -4.881,-3.75; 33 4.881,-3.75; 34 4.881,-3.25; 35 4.881,-2.75; 36 4.881,-2.25; 37 4.881,-1.75; 38 4.881,-1.25; 39 4.881,-0.75; 40 4.881,-0.25; 41 4.881,0.25; 42 4.881,0.75; 43 4.881,1.25; 44 4.881,1.75; 45 4.881,2.25; 46 4.881,2.75; 47 4.881,3.25; 48 4.881,3.75 | smd 0.28 x 1.562: 17 -3.75,-4.881; 18 -3.25,-4.881; 19 -2.75,-4.881; 20 -2.25,-4.881; 21 -1.75,-4.881; 22 -1.25,-4.881; 23 -0.75,-4.881; 24 -0.25,-4.881; 25 0.25,-4.881; 26 0.75,-4.881; 27 1.25,-4.881; 28 1.75,-4.881; 29 2.25,-4.881; 30 2.75,-4.881; 31 3.25,-4.881; 32 3.75,-4.881; 49 3.75,4.881; 50 3.25,4.881; 51 2.75,4.881; 52 2.25,4.881; 53 1.75,4.881; 54 1.25,4.881; 55 0.75,4.881; 56 0.25,4.881; 57 -0.25,4.881; 58 -0.75,4.881; 59 -1.25,4.881; 60 -1.75,4.881; 61 -2.25,4.881; 62 -2.75,4.881; 63 -3.25,4.881; 64 -3.75,4.881
LSM9DS1TR9-AXISIMU = smd 0.3 x 0.95: C1 -1.075,1.525; CAP 0.215,1.525; CS_A/G -1.075,-1.525; CS_M -0.645,-1.525; DEN_A/G 1.505,-1.525; DRDY_M -0.215,-1.525; GND1 1.075,1.525; GND2 0.645,1.525; INT1_A/G 0.645,-1.525; INT2_A/G 1.075,-1.525; INT_M 0.215,-1.525; RES5 1.505,1.525; SDO_M -1.505,-1.525; VDD1 -0.215,1.525; VDD2 -0.645,1.525; VDDIO1 -1.505,1.525 | smd 0.95 x 0.3: RES1 1.775,-0.645; RES2 1.775,-0.215; RES3 1.775,0.215; RES4 1.775,0.645; SCL/SPC -1.775,0.645; SDA/SDI/SDO -1.775,-0.215; SDO_A/G -1.775,-0.645; VDDIO2 -1.775,0.215
SOT23-DBV = smd 0.55 x 1.2: 1 -0.95,-1.3; 2 0,-1.3; 3 0.95,-1.3; 4 0.95,1.3; 5 -0.95,1.3
CRYSTAL-SMD-5X3 = smd 1.9 x 1.1: 1 -1.85,-1.15; 2 1.85,-1.15; 3 1.85,1.15; 4 -1.85,1.15

### Placement (x,y rotation side)
A1  71.4,88.03 270 top
B1  72.3,83.3 270 top
B2  85.3,54.3 270 top
C1  70.3,66.3 90 top
C2  80.3,69.3 90 top
C3  68.3,83.3 180 top
C4  72.3,86.3 0 top
C5  85.3,73.3 270 top
C6  85.3,77.3 270 top
C7  64.3,77.3 270 top
C8  80.3,81.3 90 top
C9  46.3,51.3 0 top
C10  40.3,45.3 270 top
C11  94.3,51.3 270 top
C12  101.3,69.3 90 top
C13  35.3,71.3 90 top
C14  79.3,36.3 0 top
C15  80.3,43.3 270 top
C16  88.3,43.3 270 top
C17  59.3,65.3 90 top
C18  68.3,60.3 270 top
C19  70.3,62.3 90 top
C20  62.3,60.3 270 top
C21  65.3,60.3 90 top
D2  105.3,56.3 180 top
D3  34.3,42.3 270 top
D4  94.3,41.3 270 top
D5  96.3,73.3 90 top
D6  28.3,72.3 90 top
D7  39.3,69.3 0 top
D8  37.3,63.3 0 top
D9  38.3,84.3 0 top
D10  38.3,79.3 0 top
D11  38.3,74.3 0 top
D69  22.3,57.3 0 top
J1  53.3,46.3 180 top
J2  50.3,56.3 0 top
J3  86.3,48.3 180 top
J4  78.3,31.3 180 top
JP2  59.3,24.3 0 top
LABELS  [LAYER_LABELS]  176.3,75.3 0 top  (outside the outline)
MP1  89.3,35.3 180 top
MP2  96.3,78.3 180 top
MP3  33.3,79.3 180 top
MP4  41.3,37.3 0 top
NB1  90.3,55.3 90 top
PIG1  [PIG]  60.3,111.1 180 top
PIG2  [PIG]  70.3,111.1 180 top
Q1  33.3,35.3 0 top
Q2  96.3,34.3 90 top
Q3  103.3,79.3 180 top
Q4  29.3,80.3 180 top
Q5  55.3,75.3 90 top
Q6  55.3,81.3 90 top
Q7  48.3,64.3 90 top
Q8  55.3,64.3 90 top
R1  72.3,51.3 90 top
R2  35.3,85.3 0 top
R3  88.3,85.3 0 top
R4  35.3,51.3 270 top
R5  97.3,31.3 270 top
R6  91.3,78.3 90 top
R7  28.3,65.3 90 top
R8  46.3,60.3 0 top
R9  69.3,46.3 270 top
R10  68.3,51.3 90 top
R11  60.3,80.3 0 top
R12  60.3,75.3 0 top
R13  64.3,72.3 270 top
R14  54.3,71.3 0 top
R15  47.3,71.3 0 top
R16  46.3,84.3 0 top
R17  46.3,79.3 0 top
R18  47.3,75.3 0 top
SW2  52.3,37.3 180 top
U1  72.3,75.3 270 top
U2  65.3,65.3 180 top
U3  84.3,43.3 270 top
Y1  81.3,75.3 90 top

### Tracks (layer width: path | path; a pad name or v marks a point on that pad's centre or on a via)
3V3  (via drill 0.2)
  Top 0.254: 67.46,66.09 67.37,65.99 67.12,65.99 U2.SDO_A/G | 67.46,66.09 67.46,66.23 67.37,66.32 67.3,66.32 U2.SDO_M 66.8,66.92 66.8,67.55 66.37,67.55 | v67.68,66.61 67.68,66.3 67.46,66.09 | U2.VDDIO2 67.1,65.06 67.65,65.06 67.8,64.91 67.8,64.8 v68.16,64.45 68.15,64.42 69.3,64.42 | 70.3,52.3 72.3,52.3 R1.2 | 70.3,52.3 68.3,52.3 R10.2 | 69.3,45.42 R9.2 | 69.42,45.3 R9.2 | JP2.VCC 66.8,24.3 66.8,25.55 61.3,25.55 55.55,31.3 J4.10 55.55,31.42 57.17,33.05 57.17,45.05 54.67,47.55 54.67,51.92 J2.1 | C2.1 80.3,67.99 80.23,67.92 80.11,68.04 v78.9,68.04 78.3,68.04 78.3,73.92 78.17,74.05 U1.54 74.05,74.05 | U1.44 74.05,74.05 | U1.59 74.05,76.55 74.05,74.05 | 68.3,62.3 68.74,61.86 69.3,62.42 69.3,64.42 | U2.VDDIO1 67.48,63.77 68.3,63.09 68.3,62.3 | 70.3,60.3 69.4,61.19 C18.1 68.3,62.3 | 70.3,60.3 C19.1 | U1.23 68.45,76.05 69.07,75.43 69.07,70.44 U1.34 v69.05,68.8 | 65.8,63.05 65.92,63.05 65.92,63.67 U2.VDD2 | 65.8,63.05 65.67,63.05 65.55,63.17 65.55,63.67 U2.VDD1 | v65.8,62.16 65.8,63.05 | 65.92,67.55 65.92,66.92 U2.CS_M | 65.92,67.55 65.92,67.67 64.05,67.67 63.8,67.42 63.8,66.92 U2.DEN_A/G | 69.3,64.42 70.3,64.42 C1.1 | 66.37,67.55 65.92,67.55 | U2.CS_A/G 66.37,67.55 | C20.1 63.32,62.21 v63.43,62.21 | v74.78,40.83 76.18,39.43 C14.1 | C16.2 88.3,41.1 v88.37,41.03 | v86.7,43.64 86.09,44.25 U3.5 | R9.2 69.86,44.78 v70.69,44.78 | R9.2 69.15,45.34 v67.63,46.87 | 70.3,52.3 70.3,52.83 v70.23,52.9 | v70.84,59.67 70.84,59.76 70.3,60.3
  Route15 0.254: 68.61,66.06 68.42,66.05 68.26,66.05 v67.68,66.61
  Bottom 0.254: v67.68,66.61 67.68,64.93 v68.16,64.45 | v63.43,62.21 63.68,61.96 65.6,61.96 v65.8,62.16
  pour Route15: 58.3,86.3 65.3,86.3 65.3,81.3 78.3,81.3 78.3,86.3 90.3,86.3 90.3,68.3 87.3,65.3 75.3,65.3 75.3,45.3 91.3,45.3 91.3,40.3 62.3,40.3 60.3,42.3 47.3,42.3 46.3,43.3 46.3,58.3 47.3,59.3 58.3,59.3
A2
  Top 0.127: U1.8 72.55,82.1 B1.4
A3
  Top 0.127: C3.1 B1.2
A4
  Top 0.127: U1.9 72.05,82.1 B1.3
ANT1
  Top 0.127: 71.5,84.23 B1.1
  Top 1.27: A1.FEED C4.1 71.4,84.23 71.5,84.23
BAT_GND  (via drill 0.61)
  Top 0.762: 97.05,36.8 Q2.S 98.85,36.75 v99.3,36.3 | C11.2 94.3,47.3 v95.3,46.3 | 100.92,80.05 Q3.S 100.79,80.01 100.79,80.16 102.13,81.5 v101.71,81.93 | C12.2 103.18,74.3 v104.3,74.3 | v45.05,60.92 R8.P1 | v49.05,67.92 49.05,66.8 Q7.S | v56.05,67.92 56.05,66.8 Q8.S | v56.05,78.92 56.05,77.8 Q5.S | v25.67,80.92 26.8,80.92 Q4.S | v56.05,84.92 56.05,83.8 Q6.S | v35.3,72.55 C13.2 | B2.1 v85.3,58.3 | NB1.2 v90.3,57.3 | v78.17,47.3 78.17,44.42 80.19,42.4 C15.2 | C10.2 v40.3,40.3 | Q1.S 35.75,32.85 v36.67,31.92
  Bottom 0.762: v85.3,58.3 90.3,58.3 v90.3,57.3
  pour Route2: 57.3,86.3 18.3,86.3 18.3,41.3 40.3,19.3 90.3,19.3 120.3,49.3 120.3,77.3 110.3,87.3 91.3,87.3 91.3,67.3 87.3,63.3 77.3,63.3 77.3,46.3 92.3,46.3 92.3,39.3 61.3,39.3 59.3,41.3 46.3,41.3 45.3,42.3 45.3,59.3 46.3,60.3 56.3,60.3 57.3,61.3
BLUE
  Top 0.127: D8.C 42.3,63.92 42.8,63.42 46.17,63.42 48.3,61.3 48.3,60.92 R8.P2
CUTOUT-IMU
  cutout Top: 62.3,68.3 62.3,62.3 68.3,62.3 68.3,68.3
CUTOUT-IMU1
  cutout Route15: 62.3,68.3 62.3,62.3 68.3,62.3 68.3,68.3
GND  (via drill 0.2, 0.24, 0.35, 0.61)
  Top 0.254: 66.3,75.55 U1.24 | v69.55,69.17 U1.35 69.55,71.87 v69.93,71.87 | R13.1 C7.2 | v28.3,58.3 26.82,58.3 D69.C | R4.1 v35.3,53.65 | U1.33 68.55,71.68 v68.58,71.68 | C17.2 60.3,66.19 v60.3,68.3 | U2.RES2 62.3,65.51 v62.3,65.3 | 63.94,63.13 63.84,63.23 63.84,63.72 U2.RES5 | U2.GND2 64.6,63.72 64.6,63.23 64.51,63.13 64.24,63.13 | 63.94,63.13 64.23,63.13 | 64.23,63.13 64.24,63.13 | U2.GND1 64.22,63.14 64.23,63.13 | v61.13,61.5 62.76,63.13 63.94,63.13 | v63.54,61.4 64.24,62.1 64.24,63.13 | C2.2 78.71,70.19 78.71,74.55 U1.55 77.16,74.52 74.6,74.52 v74.6,74.65 74.6,76.05 U1.58 v78.77,76.05 v78.77,76.06 | 72.8,79.05 73.05,79.3 U1.7 73.05,81.75 73.1,81.8 78.3,81.8 | 72.8,79.05 72.8,77.55 U1.61 78.3,77.55 78.3,81.8 | 72.8,79.05 71.55,79.05 U1.10 71.57,80.2 71.57,81.09 71.6,81.12 71.6,81.8 71.1,81.8 71.05,81.75 U1.11 | 66.42,77.55 66.3,77.42 | U1.20 66.42,77.55 | 66.42,77.55 65.86,77.55 v65.86,77.7 | NB1.1 v90.3,49.3 | v90.15,44.7 89.14,43.69 C16.1 | v74.61,73.52 74.55,73.46 U1.45 | 78.3,81.8 78.3,82.3 80.3,82.3 C8.2
  Bottom 0.254: v28.3,58.3 28.3,61.3 35.3,61.3 v35.3,53.65 | v68.58,71.68 68.58,71.87 v69.93,71.87 | v60.3,68.3 60.3,65.3 v62.3,65.3 | v90.3,49.3 90.3,44.55 v90.15,44.7 | v74.6,74.65 v74.6,73.53 v74.61,73.52
  other vias: 52.92,58.3 69.05,81.8 70.05,81.8
  pour Top: 17.3,87.3 110.3,87.3 120.3,77.3 120.3,49.3 90.3,19.3 40.3,19.3 17.3,42.3
  pour Bottom: 16.3,87.3 110.3,87.3 120.3,77.3 120.3,49.3 90.3,19.3 40.3,19.3 16.3,43.3
  pour Route2: 58.3,86.3 65.3,86.3 65.3,81.3 78.3,81.3 78.3,86.3 90.3,86.3 90.3,68.3 87.3,65.3 75.3,65.3 75.3,45.3 91.3,45.3 91.3,40.3 62.3,40.3 60.3,42.3 47.3,42.3 46.3,43.3 46.3,58.3 47.3,59.3 58.3,59.3
GREEN  (via drill 0.35)
  Top 0.127: Q8.G 56.67,64.8 58.3,66.42 58.3,66.92 58.05,67.17 58.05,67.42 55.3,70.17 55.3,71.3 R14.2
  Top 0.152: R14.2 v62.3,71.3 | v66.3,81.05 v63.3,81.05 | U1.50 77.1,72.12 76.32,72.12 75.9,72.55 v75.3,72.55
  Bottom 0.152: v62.3,71.3 62.3,80.05 v63.3,81.05 | v66.3,81.05 67.05,80.3 67.05,79.97 74.47,72.55 v75.3,72.55
IMUCUTOUTFORREALS
  cutout Bottom: 62.3,68.3 62.3,62.3 68.3,62.3 68.3,68.3
IMUSTOPIT
  cutout Route2: 62.3,68.3 62.3,62.3 68.3,62.3 68.3,68.3
MISO  (via drill 0.2)
  Top 0.127: v68.96,65.56 69.17,65.77 69.17,67.45 70.62,68.9 71.53,68.9 71.53,68.98 71.5,69 71.5,70.37 U1.39 | v56.42,51.8 55.92,51.3 55.92,48.92 J1.1
  Route2 0.127: v68.96,65.56 68.96,64.56 67.45,63.05 65.96,63.05 60.17,57.26 60.17,55.55 v56.42,51.8
MOSI  (via drill 0.2, 0.61)
  Top 0.127: U1.38 71.05,71.3 v70.67,71.67
  Top 0.254: J1.4 v53.3,40.6
  Route2 0.127: v70.67,71.67 69.12,70.12 65.19,70.12 58.8,63.73 58.8,59.17 58.42,58.8 47.17,58.8 46.8,58.42 46.8,45.17 48.67,43.3 52.67,43.3 53.3,42.67 v53.3,40.6
N$1
  Top 0.152: U1.56 80.85,75.05 Y1.1 84.55,73.45 C5.1
N$2
  Top 0.152: C6.1 85.3,78.3 81.3,78.3 Y1.3 80.15,76.65 79.05,75.55 U1.57
N$3
  Top 0.127: D2.A 105.52,57.2 89.05,73.67 89.05,82.8 87.3,84.55 87.3,85.3 R3.1
N$4
  Bottom 0.762: J3.2 83.76,51.49 B2.2
N$5
  Top 0.127: U1.22 68.42,76.55 68.42,76.92 68.3,77.05 U1.21
  Top 0.152: C7.1 65.4,78.19 65.4,77.3 65.4,77.07 65.4,77.05 U1.21
N$6
  Top 0.152: U1.60 79.3,77.05 79.3,80.4 C8.1
N$7
  Top 0.127: D7.C 41.05,68.42 41.67,68.42 45.8,72.55 45.8,72.92 46.3,73.42 48.3,73.42 49.3,72.42 49.3,71.92 R15.P2
N$8
  Top 0.127: R15.P1 47.3,71.92 47.3,71.55 50.8,68.05 51.05,68.05 53.42,65.67 Q8.D
N$9  (via drill 0.2)
  Top 0.127: v47.17,74.92 47.17,75.92 R18.P1 | v47.17,67.67 47.17,66.42 46.55,65.8 Q7.D
  Bottom 0.127: v47.17,67.67 v47.17,74.92
N$13
  Top 0.127: D9.C 43.8,84.92 45.3,86.42 47.3,86.42 48.3,85.42 48.3,84.92 R16.P2
N$14
  Top 0.127: R16.P1 46.3,84.92 46.3,84.55 48.05,82.8 53.42,82.8 Q6.D
N$16
  Top 0.127: D10.C 43.8,79.92 45.3,81.42 47.3,81.42 48.3,80.42 48.3,79.92 R17.P2
N$17
  Top 0.127: D11.C 45.8,74.92 46.3,74.42 48.3,74.42 49.3,75.42 49.3,75.92 R18.P2
N$18
  Top 0.127: R17.P1 46.3,79.92 46.3,79.55 48.42,77.42 52.8,77.42 53.42,76.8 Q5.D
N$22
  Top 0.127: D69.A 24.17,57.92 24.17,58.3 28.8,62.92 29.3,62.92 32.3,65.92 32.3,76.3 34.54,78.54 34.54,85.3 R2.1
N$33
  Top 0.127: JP2.DTR 59.3,24.67 53.67,30.3 53.67,36.8 45.42,45.05 45.42,51.3 C9.1
N$35
  Top 0.762: D3.A 34.3,37.63 Q1.D 40.54,37.17 MP4.2
N$42  (via drill 0.61)
  Top 0.762: v97.05,38.17 95.42,39.8 94.8,39.8 94.67,39.67 D4.A 94.3,36.05 94.55,35.8 Q2.D 93.97,35.3 MP1.2
N$44
  Top 0.762: MP2.2 99.3,78.3 100.92,76.67 Q3.D 101.8,77.55 99.21,74.96 D5.A
N$45  (via drill 0.2)
  Top 0.127: U2.CAP v65.09,62.8 | C17.1 58.37,64.4 v57.89,63.92
  Bottom 0.127: v65.09,62.8 64.96,62.92 62.55,62.92 61.49,63.98 57.95,63.98 v57.89,63.92
N$46
  Top 0.762: D6.A 28.3,78.3 28.17,78.42 27.92,78.42 Q4.D 32.08,78.43 32.09,78.41 33.26,78.41 33.56,78.71 33.56,78.93 MP3.2
N$50
  Top 0.254: C21.2 65.71,61.61 66.03,61.61 66.37,61.95 U2.C1
ORANGE  (via drill 0.35)
  Top 0.127: R11.2 61.25,79.63 57.42,75.8 Q5.G
  Top 0.152: R11.2 61.25,81.25 v61.55,81.55 | v63.3,81.8 66.3,81.8 v67.55,80.55 | U1.51 76.3,72.55 v75.55,73.3
  Bottom 0.152: v63.3,81.8 63.05,81.55 v61.55,81.55 | v67.55,80.55 69.62,78.48 69.62,77.9 74.43,73.09 74.79,73.09 75,73.3 v75.55,73.3
PG0  (via drill 0.2)
  Top 0.127: v88.42,85.3 R3.2 | v70.05,78.8 69.55,79.3 U1.14
  Bottom 0.127: v88.42,85.3 88.42,84.3 84.42,84.3 82.92,82.8 74.05,82.8 v70.05,78.8
PG1
  Top 0.127: U1.15 69.05,81.05 68.92,81.17 67.55,81.17 60.92,87.8 38.8,87.8 36.3,85.3 R2.2
PWM1  (via drill 0.2)
  Top 0.127: 95.55,33.05 95.55,31.42 96.55,30.42 97.3,30.42 R5.2 | 95.55,33.05 96.92,34.42 96.92,34.8 Q2.G | U1.43 73.55,69.17 73.3,68.92 73.3,63.67 83.55,53.42 83.55,52.42 84.42,51.55 86.05,51.55 92.8,44.8 92.8,38.05 92.3,37.55 v92.3,37.3 | 92.3,33.92 v92.3,34.3 | 92.3,33.92 93.17,33.05 95.55,33.05 | 92.3,33.92 84.42,33.92 79.92,29.42 67.55,29.42 65.67,31.3 J4.6
  Bottom 0.127: v92.3,34.3 v92.3,37.3
PWM2  (via drill 0.2)
  Top 0.127: v93.42,76.17 93.42,78.17 91.3,78.17 R6.2 | v101.92,79.42 102.42,79.92 102.8,79.92 Q3.G | U1.42 73.05,69.3 v72.92,69.17
  Route15 0.127: v72.92,69.17 77.67,64.42 77.67,57.05 72.8,52.17 72.8,50.8 64.17,42.17 64.17,33.55 63.17,32.55 63.17,31.3 J4.7
  Bottom 0.127: v101.92,79.42 101.92,78.67 99.42,76.17 v93.42,76.17 92.55,75.3 81.3,75.3 75.17,69.17 v72.92,69.17
PWM3  (via drill 0.2)
  Top 0.127: Q4.G 28.8,80.92 29.17,80.92 29.77,80.33 v30.29,80.33 | U1.41 72.55,71.42 v72.3,71.67 | R7.2 29.54,67.5 v29.64,67.5
  Bottom 0.127: v30.29,80.33 v30.3,80.33 | v30.3,80.33 30.7,80.33 38.17,87.8 58.17,87.8 65.17,80.8 65.17,79.73 69.3,75.6 69.3,73.67 71.3,71.67 v72.3,71.67 72.42,71.67 72.42,69.05 72.67,68.8 72.67,62.92 72.55,62.8 72.55,56.92 69.05,53.42 69.05,40.8 60.55,32.3 60.55,31.3 J4.8 | v29.64,67.5 29.64,79.67 v30.3,80.33
PWM4  (via drill 0.2)
  Top 0.127: U1.40 72.05,69.3 v71.92,69.17 | R4.2 35.3,49.56 32.91,47.17 32.91,39.84 32.9,39.85 31.67,38.63 v31.67,35.92 32.52,35.92 Q1.G
  Bottom 0.127: v71.92,69.17 69.42,66.67 69.42,62.42 69.05,62.05 69.05,61.92 67.05,59.92 67.05,55.17 66.67,54.8 66.67,50.92 66.92,50.92 68.67,49.17 68.67,40.8 67.17,40.8 58.05,31.67 | 58.05,31.67 58.05,31.3 J4.9 58.05,31.67 | v31.67,35.92 31.67,33.42 55.67,33.42 57.42,31.67 58.05,31.67
RED
  Top 0.127: R12.2 62.17,75.3 62.17,79.3 62.17,82.05 56.3,82.05 56.05,81.8 Q6.G
  Top 0.152: U1.19 67.34,78.12 66.52,78.12 65.35,79.3 62.17,79.3
RESET  (via drill 0.2)
  Top 0.127: C9.2 48.3,51.3 J1.5 50.67,48.8 50.67,48.17 49.3,46.8 49.3,42.42 55.92,35.8 | v71.17,49.8 71.67,50.3 72.3,50.3 R1.1 | v56.67,36.92 55.92,36.17 55.92,35.8 | U1.12 70.55,79.18 73.55,76.18 73.55,72.67 v73.22,72.34 | 55.92,35.8 SW2.3
  Route2 0.127: v56.67,36.92 62.55,42.8 64.3,42.8 71.17,49.67 v71.17,49.8 81.8,60.42 81.8,63.42 73.22,72 v73.22,72.34
RX0  (via drill 0.2)
  Top 0.127: v75.05,67.92 U1.46
  Bottom 0.127: v75.05,67.92 73.05,65.92 73.05,57.42 72.92,57.3 72.92,54.8 73.67,54.05 73.67,33.05 73.42,33.05 72.17,31.8 72.17,30.42 67.92,26.17 65.92,26.17 64.42,24.67 64.42,24.3 JP2.TXO
SCK  (via drill 0.2)
  Top 0.127: U1.37 70.55,69.38 69.3,68.13 v69.09,68.13 | v54.17,50.8 53.3,49.92 J1.3
  Route2 0.127: v69.09,68.13 63.59,68.13 59.8,64.34 59.8,55.55 56.55,52.3 55.67,52.3 v54.17,50.8
SCL  (via drill 0.2)
  Top 0.127: v68.79,62.83 68.81,63.19 67.34,64.65 U2.SCL/SPC | v68.17,49.05 69.3,47.92 R9.1 69.3,46.67 v69.55,46.42 | v68.58,75.08 67.45,75.08 U1.25
  Bottom 0.127: 58.05,59.17 55.42,56.55 55.42,56.3 J2.3 | 58.05,59.17 61.8,62.92 62.17,62.92 62.43,62.67 64.53,62.67 64.9,62.3 65.21,62.3 65.73,62.81 68.79,62.81 v68.79,62.83 68.79,64.8 68.14,65.45 68.14,67.45 67.3,68.3 67.3,74.79 67.58,75.08 v68.58,75.08 | 58.05,59.17 v68.17,49.05 | v69.55,46.42 69.55,34.05 70.8,32.8 70.8,31.3 J4.4
SDA
  Top 0.127: U2.SDA/SDI/SDO 67.09,65.5 68.51,65.5 68.51,67.07 66.82,68.76 65.87,68.76 | 65.87,68.76 65.8,68.84 65.8,73.8 66.55,74.55 U1.26 | 66.67,50.42 64.17,50.42 58.3,56.3 58.17,56.3 | 66.67,50.42 68.3,50.42 R10.1 | J2.4 58.17,56.3 | 66.67,50.42 66.67,41.55 75.67,32.55 75.67,31.3 J4.2 | 65.87,68.76 64.04,68.76 61.55,66.27 61.55,62.67 58.17,59.3 58.17,56.3
TX0  (via drill 0.2)
  Top 0.127: U1.47 75.55,69.55 75.8,69.3 75.92,69.3 82.3,62.92 v82.3,60.42
  Route15 0.127: v82.3,60.42 73.17,51.3 73.17,50.67 64.55,42.05 64.55,32.17 64.3,31.92 64.3,27.05 61.92,24.67 61.92,24.3 JP2.RXI
VBAT  (via drill 0.61)
  Top 0.762: D7.A 38.92,68.3 35.3,68.3 C13.1 | 39.05,63.92 D8.A | 39.05,67.92 D7.A | 39.05,63.55 D8.A | D4.C 94.3,43.05 93.42,43.92 v93.55,44.05 | 94.3,54.3 C11.1 | 94.42,54.8 C11.1 | v27.3,70.67 28.3,70.67 D6.C | 40.17,76.17 40.17,79.92 D10.A 40.17,80.3 40.17,84.92 D9.A | 40.17,76.17 40.17,74.92 D11.A | v39.8,76.17 40.17,76.17 | v101.3,68.05 C12.1 | 40.42,48.05 C10.1 v40.3,51.3 | U3.3 82.83,42.51 82.19,42.51 81.89,42.81 81.89,43.46 81.15,44.19 C15.1 80.4,44.3 82.92,44.3 U3.1 82.87,44.25 v79.97,47.15 | C11.1 v94.3,57.3 | D5.C v96.3,70.12 v96.31,70.11 | D8.A 39.15,66.14 | 39.15,66.14 v39.05,66.24 | D7.A 39.15,68.2 39.15,66.14 | v36.65,45.39 35.72,45.39 D3.C | v89.3,47.3 87.3,47.3 J3.1
  pour Route15: 57.3,86.3 18.3,86.3 18.3,41.3 40.3,19.3 90.3,19.3 120.3,49.3 120.3,77.3 110.3,87.3 91.3,87.3 91.3,67.3 87.3,63.3 77.3,63.3 77.3,46.3 92.3,46.3 92.3,39.3 62.3,39.3 61.3,39.3 59.3,41.3 46.3,41.3 45.3,42.3 45.3,59.3 46.3,60.3 56.3,60.3 57.3,61.3
YELLOW  (via drill 0.35)
  Top 0.127: Q7.G 50.3,64.8 52.17,62.92 60.17,62.92 61.05,63.8 61.05,66.17 64.3,69.42 64.27,70.27 v64.3,70.3 R13.2
  Top 0.152: v64.3,80.3 v66.3,80.3 | U1.49 76.05,71.55 v75.8,71.8
  Bottom 0.152: v64.3,70.3 63.3,71.3 63.3,79.3 v64.3,80.3 | v66.3,80.3 74.8,71.8 v75.8,71.8

### Text on the board
tPlace: 3V3 | GND | SCL | SDA | 3V3 | P4 | P3 | P2 | P1 | BG | SCL | VB | SDA | GND
bPlace: 3V3 | P4 | P3 | P2 | P1 | BG | SCL | VB | SDA | GND